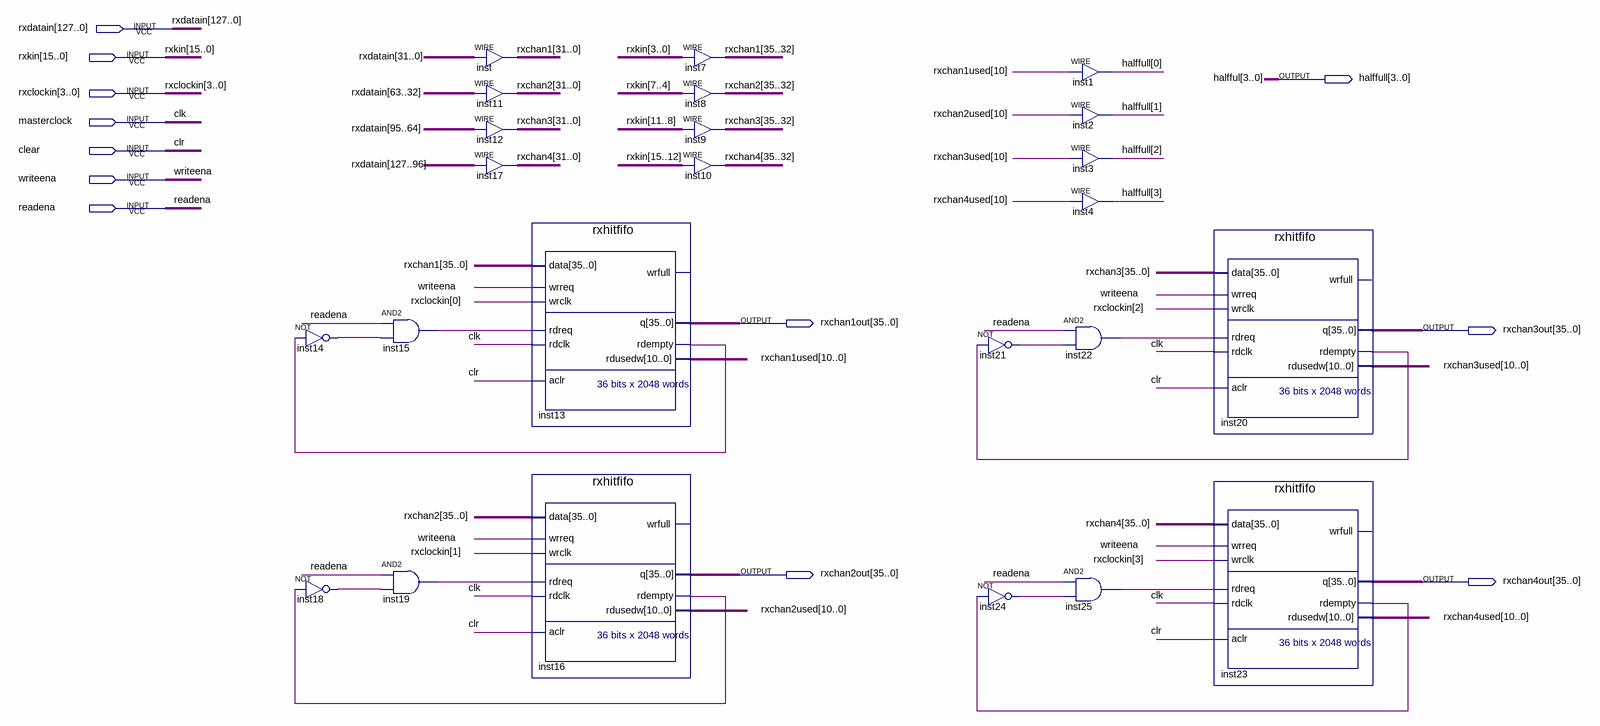
[diagram p0: schematic sheet]
// Quartus schematic FourChanHitFIFOs.bdf as structural Verilog: 24 symbols, 12 pins
module FourChanHitFIFOs (
  input  [127:0] rxdatain,
  input  [15:0] rxkin,
  input  [3:0] rxclockin,
  input  masterclock,
  input  clear,
  input  writeena,
  input  readena,
  output [3:0] halffull,
  output [35:0] rxchan1out,
  output [35:0] rxchan3out,
  output [35:0] rxchan2out,
  output [35:0] rxchan4out
);

  wire inst13_rdempty, inst14_out, inst15_out, inst16_rdempty, inst18_out, inst19_out, inst20_rdempty,
       inst21_out, inst22_out, inst23_rdempty, inst24_out, inst25_out;
  wire [10:0] rxchan1used, rxchan2used, rxchan3used, rxchan4used;
  wire [35:0] rxchan1, rxchan2, rxchan3, rxchan4;

  not inst14 (inst14_out, inst13_rdempty);
  not inst18 (inst18_out, inst16_rdempty);
  and inst15 (inst15_out, readena, inst14_out);
  and inst19 (inst19_out, readena, inst18_out);
  assign rxchan1[31:0] = rxdatain[31:0];  // WIRE inst
  assign rxchan2[31:0] = rxdatain[63:32];  // WIRE inst11
  assign rxchan3[31:0] = rxdatain[95:64];  // WIRE inst12
  assign rxchan4[31:0] = rxdatain[127:96];  // WIRE inst17
  rxhitfifo inst13 (
    .data(rxchan1), .wrreq(writeena), .wrclk(rxclockin[0]), .rdreq(inst15_out), .rdclk(masterclock),
    .aclr(clear), .q(rxchan1out), .rdempty(inst13_rdempty), .rdusedw(rxchan1used));  // open: wrfull
  rxhitfifo inst16 (
    .data(rxchan2), .wrreq(writeena), .wrclk(rxclockin[1]), .rdreq(inst19_out), .rdclk(masterclock),
    .aclr(clear), .q(rxchan2out), .rdempty(inst16_rdempty), .rdusedw(rxchan2used));  // open: wrfull
  assign rxchan1[35:32] = rxkin[3:0];  // WIRE inst7
  assign rxchan2[35:32] = rxkin[7:4];  // WIRE inst8
  assign rxchan3[35:32] = rxkin[11:8];  // WIRE inst9
  assign rxchan4[35:32] = rxkin[15:12];  // WIRE inst10
  not inst21 (inst21_out, inst20_rdempty);
  not inst24 (inst24_out, inst23_rdempty);
  assign halffull[0] = rxchan1used[10];  // WIRE inst1
  assign halffull[1] = rxchan2used[10];  // WIRE inst2
  assign halffull[2] = rxchan3used[10];  // WIRE inst3
  assign halffull[3] = rxchan4used[10];  // WIRE inst4
  and inst22 (inst22_out, readena, inst21_out);
  and inst25 (inst25_out, readena, inst24_out);
  rxhitfifo inst20 (
    .data(rxchan3), .wrreq(writeena), .wrclk(rxclockin[2]), .rdreq(inst22_out), .rdclk(masterclock),
    .aclr(clear), .q(rxchan3out), .rdempty(inst20_rdempty), .rdusedw(rxchan3used));  // open: wrfull
  rxhitfifo inst23 (
    .data(rxchan4), .wrreq(writeena), .wrclk(rxclockin[3]), .rdreq(inst25_out), .rdclk(masterclock),
    .aclr(clear), .q(rxchan4out), .rdempty(inst23_rdempty), .rdusedw(rxchan4used));  // open: wrfull

  // Other names for the same wires on the sheet: clk = masterclock; clr = clear; halfful[3:0] = halffull
endmodule
